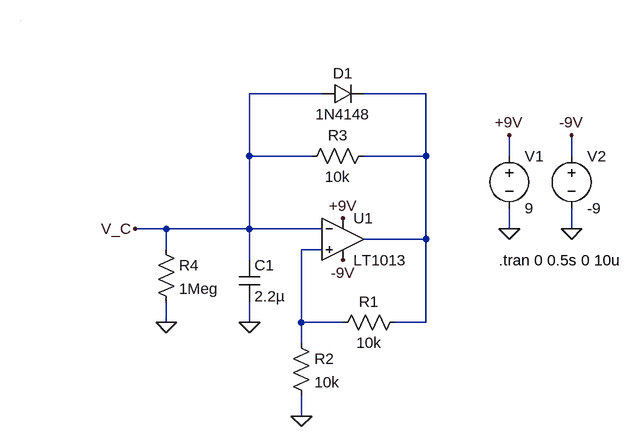
[diagram p0: schematic 260311-Synthesizer-EEE-VCOSchmitt-v1-00.asc]
260311-Synthesizer-EEE-VCOSchmitt-v1-00.asc, the LTspice schematic file:
Version 4.1
SHEET 1 1736 684
WIRE 464 112 352 112
WIRE 624 112 528 112
WIRE 352 208 352 112
WIRE 448 208 352 208
WIRE 624 208 624 112
WIRE 624 208 528 208
WIRE 752 208 752 176
WIRE 848 208 848 176
WIRE 224 320 176 320
WIRE 352 320 352 208
WIRE 352 320 224 320
WIRE 464 320 352 320
WIRE 752 320 752 288
WIRE 848 320 848 288
WIRE 624 336 624 208
WIRE 624 336 528 336
WIRE 224 352 224 320
WIRE 464 352 432 352
WIRE 352 368 352 320
WIRE 224 464 224 432
WIRE 352 464 352 432
WIRE 432 464 432 352
WIRE 496 464 432 464
WIRE 624 464 624 336
WIRE 624 464 576 464
WIRE 432 496 432 464
WIRE 432 608 432 576
WIRE 0 0 0 0
FLAG 752 320 0
FLAG 848 320 0
FLAG 752 176 +9V
FLAG 848 176 -9V
FLAG 496 304 +9V
FLAG 496 368 -9V
FLAG 432 608 0
FLAG 352 464 0
FLAG 176 320 V_C
FLAG 224 464 0
SYMBOL voltage 752 192 R0
SYMATTR InstName V1
SYMATTR Value 9
SYMBOL voltage 848 192 R0
SYMATTR InstName V2
SYMATTR Value -9
SYMBOL res 592 448 R90
WINDOW 0 0 56 VBottom 2
WINDOW 3 32 56 VTop 2
SYMATTR InstName R1
SYMATTR Value 10k
SYMBOL res 416 480 R0
SYMATTR InstName R2
SYMATTR Value 10k
SYMBOL cap 336 368 R0
SYMATTR InstName C1
SYMATTR Value 2.2µ
SYMBOL res 544 192 R90
WINDOW 0 0 56 VBottom 2
WINDOW 3 32 56 VTop 2
SYMATTR InstName R3
SYMATTR Value 10k
SYMBOL diode 464 128 R270
WINDOW 0 32 32 VTop 2
WINDOW 3 0 32 VBottom 2
SYMATTR InstName D1
SYMATTR Value 1N4148
SYMBOL OpAmps\\LT1013 496 272 R0
SYMATTR InstName U1
SYMBOL res 208 336 R0
SYMATTR InstName R4
SYMATTR Value 1Meg
TEXT 736 368 Left 2 !.tran 0 0.5s 0 10u

The netlist it stands for:
* 260311-Synthesizer-EEE-VCOSchmitt-v1-00.asc
V1 +9V 0 9
V2 -9V 0 -9
R1 N001 N002 10k
R2 N002 0 10k
C1 V_C 0 2.2µ
R3 N001 V_C 10k
D1 V_C N001 1N4148
X§U1 N002 V_C +9V -9V N001 LT1013  ; pins In+ In- V+ V- OUT
R4 V_C 0 1Meg
.model D D
.lib standard.dio
.tran 0 0.5s 0 10u
.lib LTC.lib
.backanno
.end